# EAGLE schematic UsbEuroPowerAdapter (EAGLE 9.6.1)
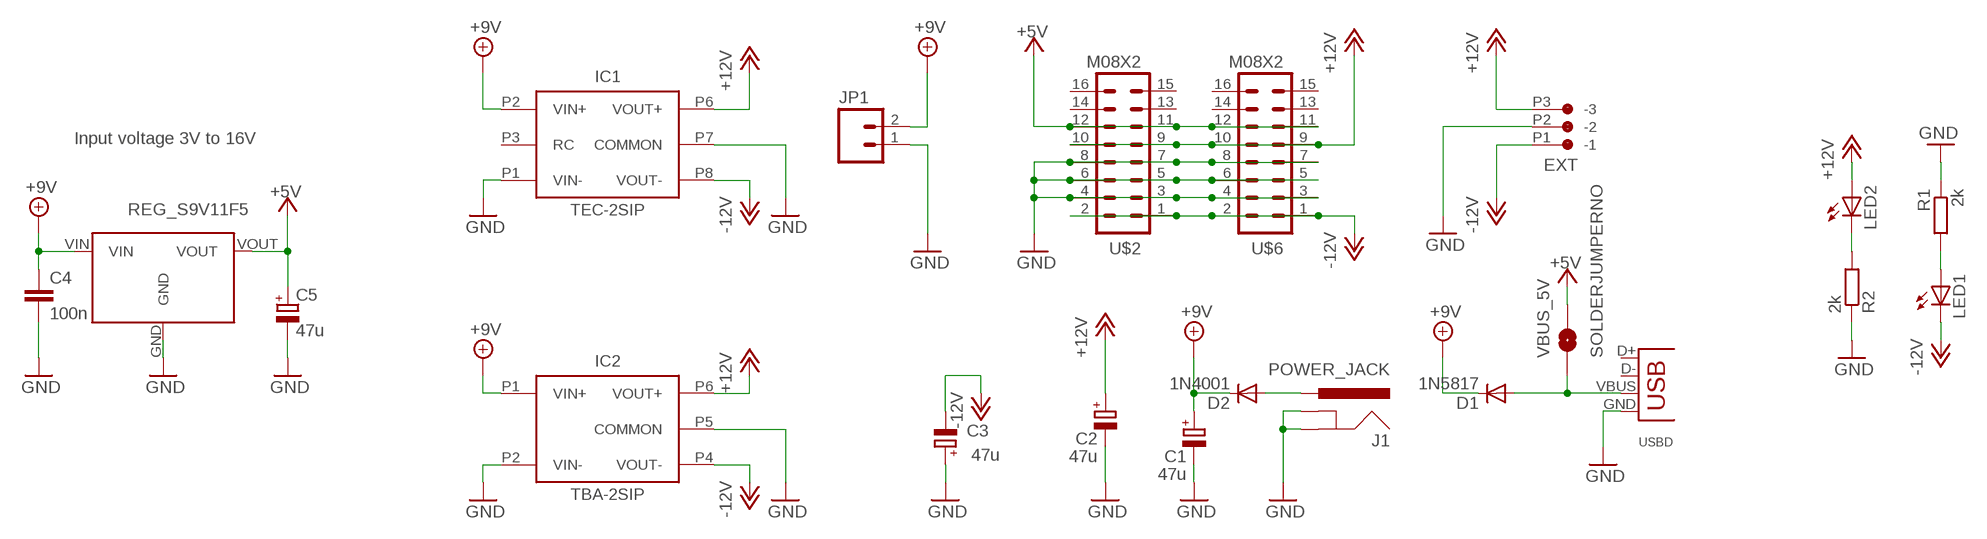
[diagram p0: schematic, sheet 1]

## Parts
C1  47u  CPOL-EUE5-6  [E5-6]
C2  47u  CPOL-EUE5-6  [E5-6]
C3  47u  CPOL-EUE5-6  [E5-6]
C4  100n  C-EU050-024X044  [C050-024X044]
C5  47u  CPOL-EUE5-6  [E5-6]
D1  1N5817  DIODEPTH  [DIODE-1N4001]
D2  1N4001  DIODEPTH  [DIODE-1N4001]
EXT  CON-JST_PH_3W  [CON-JST_PH_3W]
IC1  TEC-2SIP  [TEC-2]
IC2  TBA-2SIP  [TBA-2]
IC3  REG_S9V11F5  [REG_S9V11F5]
J1  POWER_JACK  [DC_JACK_SLOT]
JP1  M02PTH  [1X02]
LED1  LED3MM  [LED3MM]
LED2  LED3MM  [LED3MM]
R1  2k  R-EU_0204/7  [0204/7]
R2  2k  R-EU_0204/7  [0204/7]
U$2  M08X2  [2X8]
U$6  M08X2  [2X8]
USBD  USB-B-H  [USB-B-H]
VBUS_5V  SOLDERJUMPERNO  [SJ_2S-NO]

## Nets
+5V [power]: C5.+ IC3.VOUT U$2.11 U$2.12 U$6.11 U$6.12 VBUS_5V.2
+9V: C1.+ C4.1 D1.C D2.C IC1.P2(VIN+) IC2.P1(VIN+) IC3.VIN JP1.2
+12V: C2.+ EXT.P3(-3) IC1.P6(VOUT+) IC2.P6(VOUT+) LED2.A U$2.9 U$2.10 U$6.9 U$6.10
-12V: C3.- EXT.P1(-1) IC1.P8(VOUT-) IC2.P4(VOUT-) LED1.K(C) U$2.1 U$2.2 U$6.1 U$6.2
EXT_USB_D_VBUS: D1.A USBD.VBUS VBUS_5V.1
GND: C1.- C2.- C3.+ C4.2 C5.- EXT.P2(-2) IC1.P1(VIN-) IC1.P7(COMMON) IC2.P2(VIN-) IC2.P5(COMMON) IC3.GND J1.GND J1.GNDBREAK JP1.1 R1.1 R2.1 U$2.3 U$2.4 U$2.5 U$2.6 U$2.7 U$2.8 U$6.3 U$6.4 U$6.5 U$6.6 U$6.7 U$6.8 USBD.GND
N$1: LED2.K(C) R2.2
N$2: LED1.A R1.2
N$9: D2.A J1.PWR
Unconnected: IC1.P3(RC) U$2.13 U$2.14 U$2.15 U$2.16 U$6.13 U$6.14 U$6.15 U$6.16 USBD.D+ USBD.D-

## Notes on the sheet
- Input voltage 3V to 16V

## Library data of the parts
C1-C3 C5 = Rebel:CPOL-EU: POLARIZED CAPACITOR, European symbol
C4 = Rebel:C-EU: CAPACITOR, European symbol
D1 D2 = SparkFun:DIODE: Diode These are standard reverse protection diodes and small signal diodes. SMA package can handle up to about 1A. SOD-323 can handle about 200mA. What the SOD-323 package when ordering, there are some mfgs out there that are 5-pin packages.
EXT = Rebel:CON-JST_PH_3W
IC1 = Rebel:TEC-2: Traco TEC 2 or TEC 3, 9V DC nominal input. TEC 2-0922, Vin 4.5v-13.2v +/-12V 2W +/-83mA SIP TEC 3-0922, Vin 4.5v-13.2v +/-12V 3W +/-125mA SIP Traco TEC 2-1222WI, Vin 4.5v-18v +/-12V 2W +/-83mA SIP Traco TEC 3-1222WI, Vin 4.5v-18v +/-12V 3W +/-125mA SIP
IC2 = Rebel:TBA-2: Traco TBA 2 Series, 5V DC nominal input TBA 2-0522, Vin 4.5v-5.5v, +/-12V 2W +/-80mA
IC3 = Rebel:REG_S9V11F5
J1 = Rebel:POWER_JACK: Power Jack This is the standard 5.5mm barrel jack for power. The PTH is the most common, proven, reliable, footprint. All others are experimental. The Slot footprint only works if the mill layer is transmitted to the PCB fab house so be warned. Spark Fun Electronics SKU : PRT-00119. Mating wall wart : TOL-00298 (and others)
JP1 = SparkFun:M02: Header 2 Standard 2-pin 0.1" header. Use with straight break away headers (SKU : PRT-00116), right angle break away headers (PRT-00553), swiss pins (PRT-00743), machine pins (PRT-00117), and female headers (PRT-00115). Molex polarized connector foot print use with SKU : PRT-08233 with associated crimp pins and housings.
LED1 LED2 = Rebel:LED: LED
R1 R2 = Rebel:R-EU_: RESISTOR, European symbol
U$2 U$6 = SparkFun:M08X2
USBD = con-usb-3:USB: USB Connectors
VBUS_5V = SparkFun:SOLDERJUMPER: Solder Jumper Standard SMD solder jumper. Used to automate production. Two varients : Normally Open and Normally Closed are the same, but have different paste layers. NC will have a large amount of paste and should jumper during reflow.

## Net classes
1 power: width 0.178 mm, drill 0.305 mm, clearance 0.178 mm to class 0, clearance 0.178 mm